# Altium schematic sheet 7inch底板原理图.SchDoc
size A2
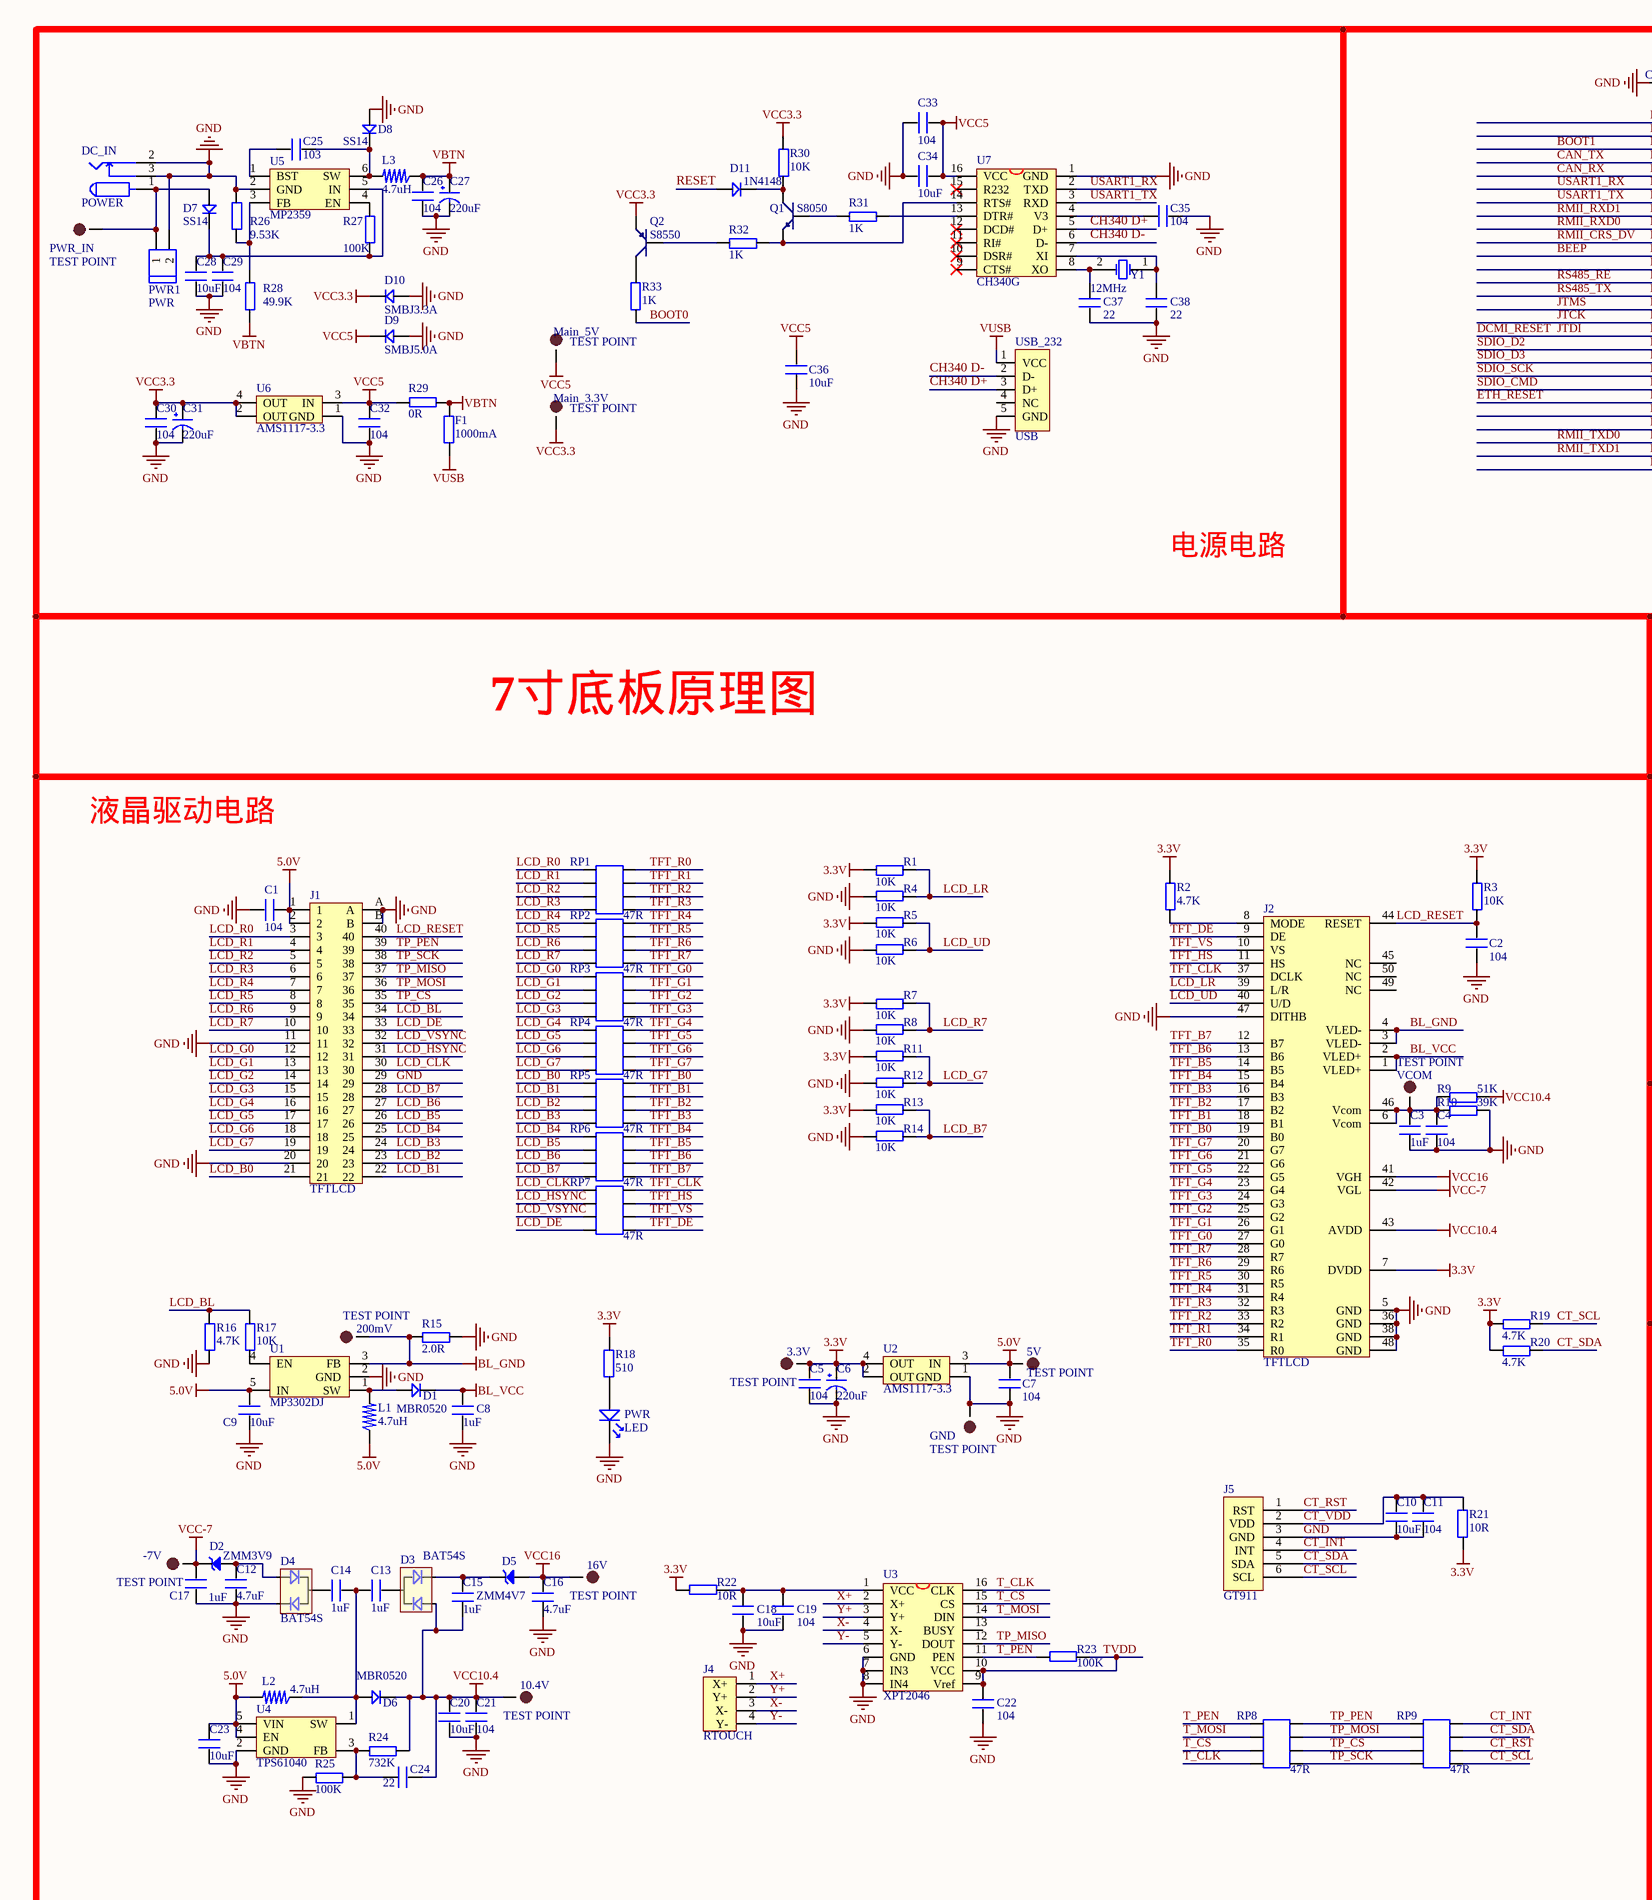
[diagram p0: 7inch底板原理图.SchDoc, left]
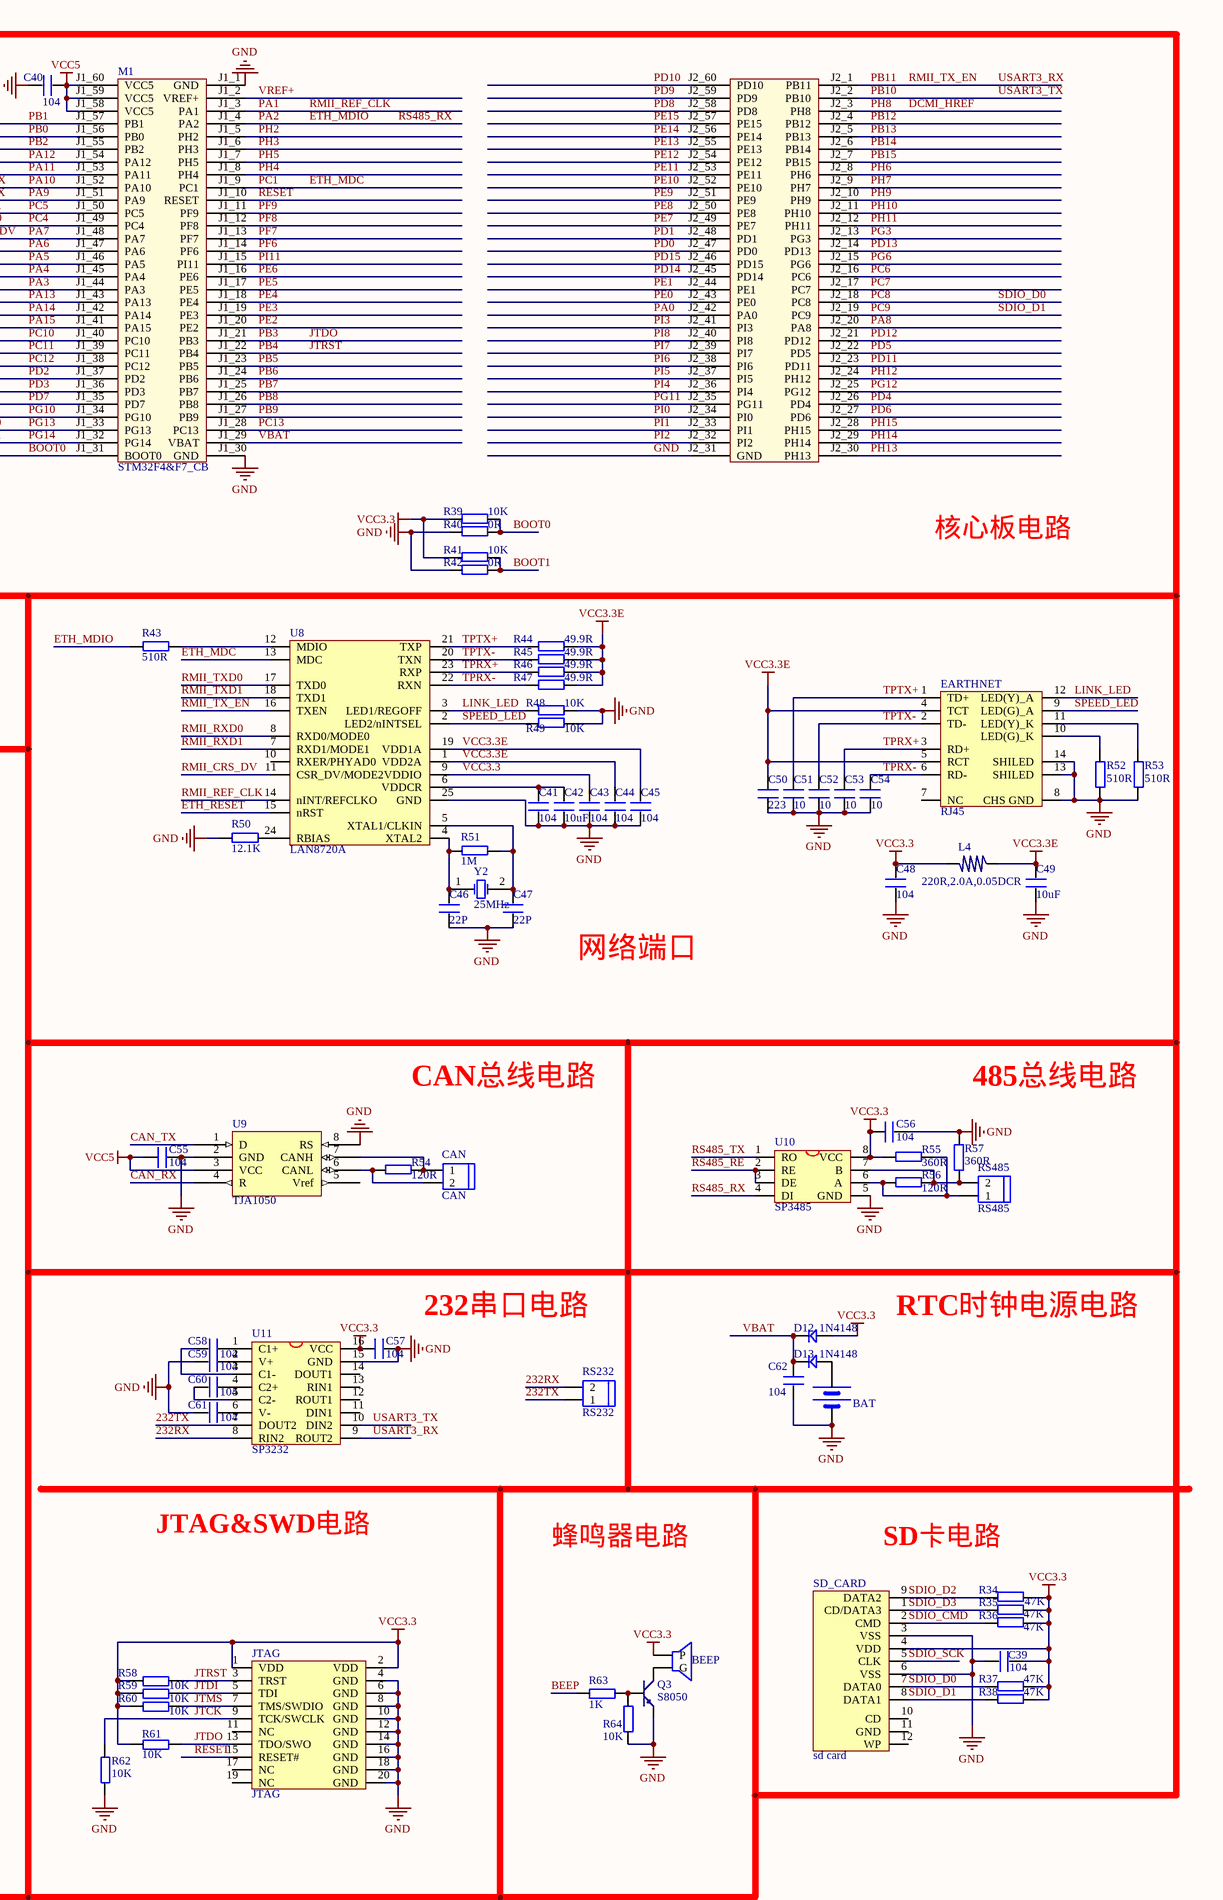
[diagram p1: 7inch底板原理图.SchDoc, right]

## Parts
3.3V  TEST POINT  [TP-1.5]
5V  TEST POINT  [TP-1.5]
10.4V  TEST POINT  [TP-1.5]
16V  TEST POINT  [TP-1.5]
200mV  TEST POINT  [TP-1.5]
-7V  TEST POINT  [TP-1.5]
BAT  BATT  [BATM]  (value not drawn)
BEEP  BEEP  [BELL-5]  (value not drawn)
C1  104  [0603P]
C2  104  [0603P]
C3  1uF  [0603P]
C4  104  [0603P]
C5  104  [0603P]
C6  220uF  [CC6.56.5]
C7  104  [0603P]
C8  1uF  [0603P]
C9  10uF  [0805]
C10  10uF  [0805]
C11  104  [0603P]
C12  4.7uF  [0805]
C13  1uF  [0603P]
C14  1uF  [0603P]
C15  1uF  [0603P]
C16  4.7uF  [0805]
C17  1uF  [0603P]
C18  10uF  [0805]
C19  104  [0603P]
C20  10uF  [0805]
C21  104  [0603P]
C22  104  [0603P]
C23  10uF  [0805]
C24  22  [0603P]
C25  103  [0603P]
C26  104  [0603P]
C27  220uF  [CC6.56.5]
C28  10uF  [0805]
C29  104  [0603P]
C30  104  [0603P]
C31  220uF  [CC6.56.5]
C32  104  [0603P]
C33  104  [0603P]
C34  10uF  [0603P]
C35  104  [0603P]
C36  10uF  [0805]
C37  22  [0603P]
C38  22  [0603P]
C39  104  [0603P]
C40  104  [0603P]
C41  104  [0603P]
C42  10uF  [0805]
C43  104  [0603P]
C44  104  [0603P]
C45  104  [0603P]
C46  22P  [0603P]
C47  22P  [0603P]
C48  104  [0603P]
C49  10uF  [0805]
C50  223  [0603P]
C51  10  [0603P]
C52  10  [0603P]
C53  10  [0603P]
C54  10  [0603P]
C55  104  [0603P]
C56  104  [0603P]
C57  104  [0603P]
C58  104  [0603P]
C59  104  [0603P]
C60  104  [0603P]
C61  104  [0603P]
C62  104  [0603P]
CAN  CAN  [HEAD2L-0.8]
D1  MBR0520  [SOD-123]
D2  ZMM3V9  [DIODE_ZMMx]
D3  BAT54S  [SOT-23]
D4  BAT54S  [SOT-23]
D5  ZMM4V7  [DIODE_ZMMx]
D6  MBR0520  [SOD-123]
D7  SS14  [DIODE_3*5.3]
D8  SS14  [DIODE_3*5.3]
D9  SMBJ5.0A  [SMBJ]
D10  SMBJ3.3A  [SMBJ]
D11  1N4148  [DIODE_SOP]
D12  1N4148  [DIODE_SOP]
D13  1N4148  [DIODE_SOP]
DC_IN  POWER  [DC10B]
EARTHNET  RJ45  [HR911105A]
F1  1000mA  [0805]
GND  TEST POINT  [TP-1.5]
J1  TFTLCD  [FPC-TOP40]
J2  TFTLCD  [FPC-TOP50]
J4  RTOUCH  [FFC/SM1.0-4]
J5  GT911  [CTOUCH_6_BTM]
JTAG  JTAG  [JTAG_20]
L1  4.7uH  [L_CD43]
L2  4.7uH  [L_CD43]
L3  4.7uH  [L_SOP74]
L4  220R,2.0A,0.05DCR  [0603P]
M1  STM32F4&F7_CB  [STM32F4&F7_CB]
Main_3.3V  TEST POINT  [TP-1.5]
Main_5V  TEST POINT  [TP-1.5]
PWR  LED  [SMDLED]
PWR1  PWR  [HEAD2L-0.8]
PWR_IN  TEST POINT  [TP-1.5]
Q1  S8050  [SOT-23R]
Q2  S8550  [SOT-23R]
Q3  S8050  [SOT-23R]
R1  10K  [0603P]
R2  4.7K  [0603P]
R3  10K  [0603P]
R4  10K  [0603P]
R5  10K  [0603P]
R6  10K  [0603P]
R7  10K  [0603P]
R8  10K  [0603P]
R9  51K  [0603P]
R10  39K  [0603P]
R11  10K  [0603P]
R12  10K  [0603P]
R13  10K  [0603P]
R14  10K  [0603P]
R15  2.0R  [0603P]
R16  4.7K  [0603P]
R17  10K  [0603P]
R18  510  [0603P]
R19  4.7K  [0603P]
R20  4.7K  [0603P]
R21  10R  [0603P]
R22  10R  [0603P]
R23  100K  [0603P]
R24  732K  [0603P]
R25  100K  [0603P]
R26  9.53K  [0603P]
R27  100K  [0603P]
R28  49.9K  [0603P]
R29  0R  [0805]
R30  10K  [0603P]
R31  1K  [0603P]
R32  1K  [0603P]
R33  1K  [0603P]
R34  47K  [0603P]
R35  47K  [0603P]
R36  47K  [0603P]
R37  47K  [0603P]
R38  47K  [0603P]
R39  10K  [0603P]
R40  0R  [0603P]
R41  10K  [0603P]
R42  0R  [0603P]
R43  510R  [0603P]
R44  49.9R  [0603P]
R45  49.9R  [0603P]
R46  49.9R  [0603P]
R47  49.9R  [0603P]
R48  10K  [0603P]
R49  10K  [0603P]
R50  12.1K  [0603P]
R51  1M  [0603P]
R52  510R  [0603P]
R53  510R  [0603P]
R54  120R  [0603P]
R55  360R  [0603P]
R56  120R  [0603P]
R57  360R  [0603P]
R58  10K  [0603P]
R59  10K  [0603P]
R60  10K  [0603P]
R61  10K  [0603P]
R62  10K  [0603P]
R63  1K  [0603P]
R64  10K  [0603P]
RP1  47R  [8P4R_0603]
RP2  47R  [8P4R_0603]
RP3  47R  [8P4R_0603]
RP4  47R  [8P4R_0603]
RP5  47R  [8P4R_0603]
RP6  47R  [8P4R_0603]
RP7  47R  [8P4R_0603]
RP8  47R  [8P4R_0603]
RP9  47R  [8P4R_0603]
RS232  RS232  [HEAD2L-0.8]
RS485  RS485  [HEAD2L-0.8]
SD_CARD  sd card  [SDCARD_L]
U1  MP3302DJ  [SOT-23-5]
U2  AMS1117-3.3  [AMS1117]
U3  XPT2046  [SSOP16]
U4  TPS61040  [SOT-23-5]
U5  MP2359  [SOT-23-6]
U6  AMS1117-3.3  [AMS1117]
U7  CH340G  [SOP16M]
U8  LAN8720A  [QFN24]
U9  TJA1050  [SOP-8]
U10  SP3485  [SOP-8]
U11  SP3232  [SOP16M]
USB_232  USB  [USB/SM0.8-6H5]
VCOM  TEST POINT  [TP-1.5]
Y1  12MHz  [XTAL_US]
Y2  25MHz  [XTAL_US]

## Nets
3.3V: 3.3V.1 C5.2 C6.1(VCC) J2.7(DVDD) R1.1 R2.2 R3.2 R5.2 R7.1 R11.2 R13.2 R18.1 R19.1 R20.1 R21.1 R22.2 U2.2(OUT) U2.4(OUT)
5.0V: 5V.1 C1.2 C7.2 C9.2 C23.2 J1.1 J1.2 L1.1 L2.2 U1.5(IN) U2.3(IN) U4.4(EN) U4.5(VIN)
BL_GND: 200mV.1 J2.3(VLED-) J2.4(VLED-) R15.1 U1.3(FB)
BL_VCC: C8.2 D1.2 J2.1(VLED+) J2.2(VLED+)
GND: BAT.2(GND) C1.1 C2.1 C3.1 C4.1 C5.1 C6.2(GND) C7.1 C8.1 C9.1 C10.2 C11.2 C12.2 C16.2 C17.2 C18.1 C19.1 C20.1 C21.1 C22.1 C23.1 C26.1 C27.2(GND) C28.1 C29.1 C30.1 C31.2(GND) C32.1 C33.2 C34.2 C35.1 C36.2 C37.1 C38.1 C39.2 C40.2 C41.1 C42.1 C43.1 C44.1 C45.1 C46.1 C47.1 C48.1 C49.1 C50.1 C51.1 C52.1 C53.1 C54.1 C55.1 C56.1 C57.1 C59.2 C61.2 C62.2 D4.2 D8.1 D9.1 D10.1 DC_IN.2 DC_IN.3 EARTHNET.8(CHS_GND) EARTHNET.13(SHILED) EARTHNET.14(SHILED) GND.1 J1.11 J1.20 J1.29 J1.A J1.B J2.5(GND) J2.36(GND) J2.38(GND) J2.47(DITHB) J2.48(GND) J5.3(GND) JTAG.4(GND) JTAG.6(GND) JTAG.8(GND) JTAG.10(GND) JTAG.12(GND) JTAG.14(GND) JTAG.16(GND) JTAG.18(GND) JTAG.20(GND) M1.J1_1(GND) M1.J1_30(GND) M1.J2_31(GND) PWR.2 PWR1.2 Q3.1(E) R4.2 R6.2 R8.2 R10.2 R12.2 R14.2 R15.2 R16.1 R25.1 R26.2 R40.2 R42.2 R48.1 R49.1 R50.2 R52.1 R53.1 R57.1 R62.1 R64.1 SD_CARD.3(VSS) SD_CARD.6(VSS) U1.2(GND) U2.1(GND) U3.6(GND) U3.7(IN3) U3.8(IN4) U4.2(GND) U5.2(GND) U6.1(GND) U7.1(GND) U8.25(GND) U9.2(GND) U9.8(RS) U10.5(GND) U11.15(GND) USB_232.5(GND)
VBTN: C26.2 C27.1(VCC) F1.1 L3.1 R28.1 R29.1
VCC3.3: BEEP.1(P) C30.2 C31.1(VCC) C39.1 C43.2 C48.2 C56.2 C57.2 D10.2 D12.1 JTAG.1(VDD) JTAG.2(VDD) L4.2 Main_3.3V.1 Q2.1(E) R30.1 R34.1 R35.1 R36.1 R37.1 R38.1 R39.2 R41.2 R55.2 R58.1 R59.1 R60.1 R61.1 SD_CARD.4(VDD) U6.2(OUT) U6.4(OUT) U8.9(VDDIO) U10.8(VCC) U11.16(VCC)
VCC3.3E: C44.2 C45.2 C49.2 C50.2 EARTHNET.4(TCT) EARTHNET.5(RCT) L4.1 R44.1 R45.1 R46.1 R47.1 U8.1(VDD2A) U8.19(VDD1A)
VCC5: C32.2 C33.1 C34.1 C36.1 C40.1 C55.2 D9.2 M1.J1_58(VCC5) M1.J1_59(VCC5) M1.J1_60(VCC5) Main_5V.1 R29.2 U6.3(IN) U7.16(VCC) U9.3(VCC)
VCC10.4: 10.4V.1 C15.2 C20.2 C21.2 C24.1 D3.1 D6.2 J2.43(AVDD) R9.2 R24.2
VCC16: 16V.1 C16.1 D5.1 J2.41(VGH)
VCC-7: -7V.1 C17.1 D2.2 J2.42(VGL)
VUSB: F1.2 USB_232.1(VCC)
232RX: RS232.2 U11.8(RIN2)
232TX: RS232.1 U11.7(DOUT2)
BEEP: M1.J1_47(PA6) R63.1  [also labelled PA6]
BOOT0: M1.J1_31(BOOT0) R33.2 R39.1 R40.1
BOOT1: M1.J1_55(PB2) R41.1 R42.1  [also labelled PB2]
CAN_RX: M1.J1_53(PA11) U9.4(R)  [also labelled PA11]
CAN_TX: M1.J1_54(PA12) U9.1(D)  [also labelled PA12]
CH340 D+: U7.5(D+) USB_232.3(D+)
CH340 D-: U7.6(D-) USB_232.2(D-)
CT_INT: J5.4(INT) RP9.8
CT_RST: J5.1(RST) RP9.4
CT_SCL: J5.6(SCL) R19.2 RP9.2
CT_SDA: J5.5(SDA) R20.2 RP9.6
CT_VDD: C10.1 C11.1 J5.2(VDD) R21.2
DCMI_HREF: M1.J2_3(PH8)  [also labelled PH8]
DCMI_RESET: JTAG.5(TDI) M1.J1_41(PA15) R59.2  [also labelled JTDI, PA15]
ETH_MDC: M1.J1_9(PC1) U8.13(MDC)  [also labelled PC1]
ETH_MDIO: M1.J1_4(PA2) R43.2 U10.4(DI)  [also labelled PA2, RS485_RX]
ETH_RESET: M1.J1_36(PD3) U8.15(nRST)  [also labelled PD3]
JTCK: JTAG.9(TCK/SWCLK) M1.J1_42(PA14) R62.2  [also labelled PA14]
JTDO: JTAG.13(TDO/SWO) M1.J1_21(PB3) R61.2  [also labelled PB3]
JTMS: JTAG.7(TMS/SWDIO) M1.J1_43(PA13) R60.2  [also labelled PA13]
JTRST: JTAG.3(TRST) M1.J1_22(PB4) R58.2  [also labelled PB4]
LCD_B0: J1.21 RP5.2
LCD_B1: J1.22 RP5.4
LCD_B2: J1.23 RP5.6
LCD_B3: J1.24 RP5.8
LCD_B4: J1.25 RP6.2
LCD_B5: J1.26 RP6.4
LCD_B6: J1.27 RP6.6
LCD_B7: J1.28 R13.1 R14.1 RP6.8
LCD_BL: J1.34 R16.2 R17.2
LCD_CLK: J1.30 RP7.2
LCD_DE: J1.33 RP7.8
LCD_G0: J1.12 RP3.2
LCD_G1: J1.13 RP3.4
LCD_G2: J1.14 RP3.6
LCD_G3: J1.15 RP3.8
LCD_G4: J1.16 RP4.2
LCD_G5: J1.17 RP4.4
LCD_G6: J1.18 RP4.6
LCD_G7: J1.19 R11.1 R12.1 RP4.8
LCD_HSYNC: J1.31 RP7.4
LCD_LR: J2.39(L/R) R1.2 R4.1
LCD_R0: J1.3 RP1.2
LCD_R1: J1.4 RP1.4
LCD_R2: J1.5 RP1.6
LCD_R3: J1.6 RP1.8
LCD_R4: J1.7 RP2.2
LCD_R5: J1.8 RP2.4
LCD_R6: J1.9 RP2.6
LCD_R7: J1.10 R7.2 R8.1 RP2.8
LCD_RESET: C2.2 J1.40 J2.44(RESET) R3.1
LCD_UD: J2.40(U/D) R5.1 R6.1
LCD_VSYNC: J1.32 RP7.6
LINK_LED: EARTHNET.12(LED(Y)_A) R48.2 U8.3(LED1/REGOFF)
PA0: M1.J2_42(PA0)
PA1: M1.J1_3(PA1) U8.14(nINT/REFCLKO)  [also labelled RMII_REF_CLK]
PA3: M1.J1_44(PA3) U10.1(RO)  [also labelled RS485_TX]
PA4: M1.J1_45(PA4) U10.2(RE) U10.3(DE)  [also labelled RS485_RE]
PA5: M1.J1_46(PA5)
PA7: M1.J1_48(PA7) U8.11(CSR_DV/MODE2)  [also labelled RMII_CRS_DV]
PA8: M1.J2_20(PA8)
PA9: M1.J1_51(PA9) U7.3(RXD)  [also labelled USART1_TX]
PA10: M1.J1_52(PA10) U7.2(TXD)  [also labelled USART1_RX]
PB0: M1.J1_56(PB0)
PB1: M1.J1_57(PB1)
PB5: M1.J1_23(PB5)
PB6: M1.J1_24(PB6)
PB7: M1.J1_25(PB7)
PB8: M1.J1_26(PB8)
PB9: M1.J1_27(PB9)
PB10: M1.J2_2(PB10) U11.10(DIN2)  [also labelled USART3_TX]
PB11: M1.J2_1(PB11) U8.16(TXEN) U11.9(ROUT2)  [also labelled RMII_TX_EN, USART3_RX]
PB12: M1.J2_4(PB12)
PB13: M1.J2_5(PB13)
PB14: M1.J2_6(PB14)
PB15: M1.J2_7(PB15)
PC4: M1.J1_49(PC4) U8.8(RXD0/MODE0)  [also labelled RMII_RXD0]
PC5: M1.J1_50(PC5) U8.7(RXD1/MODE1)  [also labelled RMII_RXD1]
PC6: M1.J2_16(PC6)
PC7: M1.J2_17(PC7)
PC8: M1.J2_18(PC8) R37.2 SD_CARD.7(DATA0)  [also labelled SDIO_D0]
PC9: M1.J2_19(PC9) R38.2 SD_CARD.8(DATA1)  [also labelled SDIO_D1]
PC10: M1.J1_40(PC10) R34.2 SD_CARD.9(DATA2)  [also labelled SDIO_D2]
PC11: M1.J1_39(PC11) R35.2 SD_CARD.1(CD/DATA3)  [also labelled SDIO_D3]
PC12: M1.J1_38(PC12) SD_CARD.5(CLK)  [also labelled SDIO_SCK]
PC13: M1.J1_28(PC13)
PD0: M1.J2_47(PD0)
PD1: M1.J2_48(PD1)
PD2: M1.J1_37(PD2) R36.2 SD_CARD.2(CMD)  [also labelled SDIO_CMD]
PD4: M1.J2_26(PD4)
PD5: M1.J2_22(PD5)
PD6: M1.J2_27(PD6)
PD7: M1.J1_35(PD7)
PD8: M1.J2_58(PD8)
PD9: M1.J2_59(PD9)
PD10: M1.J2_60(PD10)
PD11: M1.J2_23(PD11)
PD12: M1.J2_21(PD12)
PD13: M1.J2_14(PD13)
PD14: M1.J2_45(PD14)
PD15: M1.J2_46(PD15)
PE0: M1.J2_43(PE0)
PE1: M1.J2_44(PE1)
PE2: M1.J1_20(PE2)
PE3: M1.J1_19(PE3)
PE4: M1.J1_18(PE4)
PE5: M1.J1_17(PE5)
PE6: M1.J1_16(PE6)
PE7: M1.J2_49(PE7)
PE8: M1.J2_50(PE8)
PE9: M1.J2_51(PE9)
PE10: M1.J2_52(PE10)
PE11: M1.J2_53(PE11)
PE12: M1.J2_54(PE12)
PE13: M1.J2_55(PE13)
PE14: M1.J2_56(PE14)
PE15: M1.J2_57(PE15)
PF6: M1.J1_14(PF6)
PF7: M1.J1_13(PF7)
PF8: M1.J1_12(PF8)
PF9: M1.J1_11(PF9)
PG3: M1.J2_13(PG3)
PG6: M1.J2_15(PG6)
PG10: M1.J1_34(PG10)
PG11: M1.J2_35(PG11)
PG12: M1.J2_25(PG12)
PG13: M1.J1_33(PG13) U8.17(TXD0)  [also labelled RMII_TXD0]
PG14: M1.J1_32(PG14) U8.18(TXD1)  [also labelled RMII_TXD1]
PH2: M1.J1_5(PH2)
PH3: M1.J1_6(PH3)
PH4: M1.J1_8(PH4)
PH5: M1.J1_7(PH5)
PH6: M1.J2_8(PH6)
PH7: M1.J2_9(PH7)
PH9: M1.J2_10(PH9)
PH10: M1.J2_11(PH10)
PH11: M1.J2_12(PH11)
PH12: M1.J2_24(PH12)
PH13: M1.J2_30(PH13)
PH14: M1.J2_29(PH14)
PH15: M1.J2_28(PH15)
PI0: M1.J2_34(PI0)
PI1: M1.J2_33(PI1)
PI2: M1.J2_32(PI2)
PI3: M1.J2_41(PI3)
PI4: M1.J2_36(PI4)
PI5: M1.J2_37(PI5)
PI6: M1.J2_38(PI6)
PI7: M1.J2_39(PI7)
PI8: M1.J2_40(PI8)
PI11: M1.J1_15(PI11)
RESET: D11.1 JTAG.15(RESET#) M1.J1_10(RESET)
SPEED_LED: EARTHNET.9(LED(G)_A) R49.2 U8.2(LED2/nINTSEL)
T_CLK: RP8.1 U3.16(CLK)
T_CS: RP8.3 U3.15(CS)
T_MOSI: RP8.5 U3.14(DIN)
T_PEN: R23.2 RP8.7 U3.11(PEN)
TFT_B0: J2.19(B0) RP5.1
TFT_B1: J2.18(B1) RP5.3
TFT_B2: J2.17(B2) RP5.5
TFT_B3: J2.16(B3) RP5.7
TFT_B4: J2.15(B4) RP6.1
TFT_B5: J2.14(B5) RP6.3
TFT_B6: J2.13(B6) RP6.5
TFT_B7: J2.12(B7) RP6.7
TFT_CLK: J2.37(DCLK) RP7.1
TFT_DE: J2.9(DE) RP7.7
TFT_G0: J2.27(G0) RP3.1
TFT_G1: J2.26(G1) RP3.3
TFT_G2: J2.25(G2) RP3.5
TFT_G3: J2.24(G3) RP3.7
TFT_G4: J2.23(G4) RP4.1
TFT_G5: J2.22(G5) RP4.3
TFT_G6: J2.21(G6) RP4.5
TFT_G7: J2.20(G7) RP4.7
TFT_HS: J2.11(HS) RP7.3
TFT_R0: J2.35(R0) RP1.1
TFT_R1: J2.34(R1) RP1.3
TFT_R2: J2.33(R2) RP1.5
TFT_R3: J2.32(R3) RP1.7
TFT_R4: J2.31(R4) RP2.1
TFT_R5: J2.30(R5) RP2.3
TFT_R6: J2.29(R6) RP2.5
TFT_R7: J2.28(R7) RP2.7
TFT_VS: J2.10(VS) RP7.5
TP_CS: J1.35 RP8.4 RP9.3
TP_MISO: J1.37 U3.12(DOUT)
TP_MOSI: J1.36 RP8.6 RP9.5
TP_PEN: J1.39 RP8.8 RP9.7
TP_SCK: J1.38 RP8.2 RP9.1
TPRX+: C53.2 EARTHNET.3(RD+) R46.2 U8.23(RXP)
TPRX-: C54.2 EARTHNET.6(RD-) R47.2 U8.22(RXN)
TPTX+: C51.2 EARTHNET.1(TD+) R44.2 U8.21(TXP)
TPTX-: C52.2 EARTHNET.2(TD-) R45.2 U8.20(TXN)
TVDD: C22.2 R23.1 U3.9(Vref) U3.10(VCC)
VBAT: C62.1 D12.2 D13.2 M1.J1_29(VBAT)
VREF+: M1.J1_2(VREF+)
X+: J4.1(X+) U3.2(X+)
X-: J4.3(X-) U3.4(X-)
Y+: J4.2(Y+) U3.3(Y+)
Y-: J4.4(Y-) U3.5(Y-)
NetBAT_1: BAT.1(VCC) D13.1
NetBEEP_2: BEEP.2(G) Q3.3(C)
NetC3_2: C3.2 C4.2 J2.6(Vcom) J2.46(Vcom) R9.1 R10.1 VCOM.1
NetC12_1: C12.1 D2.1 D4.1
NetC13_1: C13.1 D3.3
NetC13_2: C13.2 C14.1 D6.1 L2.1 U4.1(SW)
NetC14_2: C14.2 D4.3
NetC15_1: C15.1 D3.2 D5.2
NetC18_2: C18.2 C19.2 R22.1 U3.1(VCC)
NetC24_2: C24.2 R24.1 R25.2 U4.3(FB)
NetC25_1: C25.1 U5.1(BST)
NetC25_2: C25.2 D8.2 L3.2 U5.6(SW)
NetC28_2: C28.2 C29.2 D7.2 R27.1 U5.5(IN)
NetC35_2: C35.2 U7.4(V3)
NetC37_2: C37.2 U7.8(XO) Y1.2(OSC2)
NetC38_2: C38.2 U7.7(XI) Y1.1(OSC1)
NetC41_2: C41.2 C42.2 U8.6(VDDCR)
NetC46_2: C46.2 R51.2 U8.4(XTAL2) Y2.1(OSC1)
NetC47_2: C47.2 R51.1 U8.5(XTAL1/CLKIN) Y2.2(OSC2)
NetC58_1: C58.1 U11.1(C1+)
NetC58_2: C58.2 U11.3(C1-)
NetC59_1: C59.1 U11.2(V+)
NetC60_1: C60.1 U11.4(C2+)
NetC60_2: C60.2 U11.5(C2-)
NetC61_1: C61.1 U11.6(V-)
NetCAN_1: CAN.1 R54.1 U9.7(CANH)
NetCAN_2: CAN.2 R54.2 U9.6(CANL)
NetD1_1: D1.1 L1.2 U1.1(SW)
NetD7_1: D7.1 DC_IN.1 PWR1.1 PWR_IN.1
NetD11_2: D11.2 Q1.3(C) R30.2
NetEARTHNET_10: EARTHNET.10(LED(G)_K) R52.2
NetEARTHNET_11: EARTHNET.11(LED(Y)_K) R53.2
NetJ2_8: J2.8(MODE) R2.1
NetPWR_1: PWR.1 R18.2
NetQ1_1: Q1.1(E) R32.1 U7.14(RTS#)
NetQ1_2: Q1.2(B) R31.2
NetQ2_2: Q2.2(B) R32.2
NetQ2_3: Q2.3(C) R33.1
NetQ3_2: Q3.2(B) R63.2 R64.2
NetR17_1: R17.1 U1.4(EN)
NetR26_1: R26.1 R28.2 U5.3(FB)
NetR27_2: R27.2 U5.4(EN)
NetR31_1: R31.1 U7.13(DTR#)
NetR43_1: R43.1 U8.12(MDIO)
NetR50_1: R50.1 U8.24(RBIAS)
NetR55_1: R55.1 R56.2 RS485.1 U10.6(A)
NetR56_1: R56.1 R57.2 RS485.2 U10.7(B)

Not connected (* = marked no-connect by the designer): EARTHNET 7(NC); J2 45(NC) 49(NC) 50(NC); JTAG 11(NC) 17(NC) 19(NC); SD_CARD 10(CD) 11(GND) 12(WP); U3 13(BUSY); U7 9(CTS#)* 10(DSR#)* 11(RI#)* 12(DCD#)* 15(R232)*; U8 10(RXER/PHYAD0); U9 5(Vref); U11 11(DIN1) 12(ROUT1) 13(RIN1) 14(DOUT1); USB_232 4(NC)

## Notes on the sheet
- 电源电路
- 核心板电路
- 7寸底板原理图
- 液晶驱动电路
- 网络端口
- CAN总线电路
- 485总线电路
- (near C57) 232串口电路
- RTC时钟电源电路
- JTAG&SWD电路
- 蜂鸣器电路
- SD卡电路

## Library data of the parts
3.3V 5V 10.4V 16V 200mV -7V GND Main_3.3V Main_5V PWR_IN VCOM = TEST-POINT: 测试点
BAT = BAT
C1-C5 C7-C26 C28-C30 C32-C62 = C
C6 C27 C31 = CAP
CAN PWR1 RS232 RS485 = HEAD2
D1 D6 = D: 1N4148
D2 D5 = ZMM3V6
D3 D4 = BAT54S: 双肖特基二极管
D7-D13 = D
DC_IN = POW
EARTHNET = HR911105
F1 R1-R64 = R
J1 = FPC-40: FPC-40P-0.5mm
J2 = AT070TN92: 7' TFTLCD
J4 = RTOUCH: 7' 电阻触摸屏
L1-L3 = L_SOP
L4 = L
M1 = STM32F4&F7_CB: F429/746 Core Board
Q1 Q3 = NPN: 8050/BCW846/BCW847
Q2 = PNP: 8550/BCW68
RP1-RP9 = R_PACK: 排阻
U1 = MP3302: LCD背光IC
U2 U6 = AMS1117
U3 = ADS7843
U4 = TPS61040: DC DC Step Up IC
U5 = MP2359: DC DC Step Down IC
U7 = CH340G: USB2UART
U8 = LAN8720: ETH PHY
U9 = SN65HVD230D
U10 = MAX3485
U11 = MAX3232
USB_232 = USB5
Y1 Y2 = XTAL: Crystal Oscillator; Published: 8-Jun-2000; LatestRevisionDate: 17-Jul-2002; LatestRevisionNote: Re-released for DXP Platform.; Publisher: Altium Limited